# EAGLE design Lock (EAGLE 9.3.0)
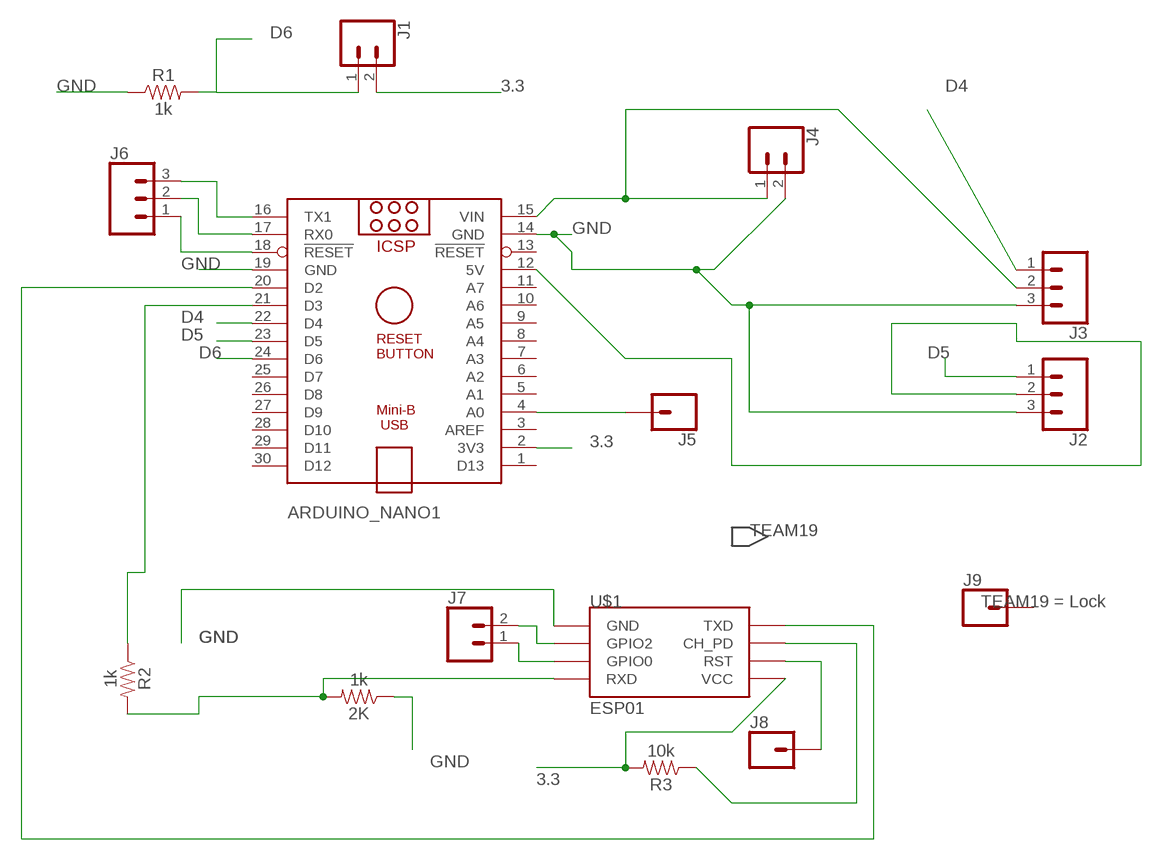
[diagram p0: schematic, sheet 1]

## Parts
2K  1k  1KOHM-HORIZ-1/4W-1%  [AXIAL-0.3]
ARDUINO_NANO1  ARDUINO_NANO  [ARDUINO_NANO]
J1  CONN_02  [1X02]
J2  CONN_03  [1X03]
J3  CONN_03  [1X03]
J4  CONN_02  [1X02]
J5  CONN_01  [1X01]
J6  CONN_03  [1X03]
J7  CONN_02  [1X02]
J8  CONN_01  [1X01]
J9  CONN_01  [1X01]
R1  1k  1KOHM-HORIZ-1/4W-1%  [AXIAL-0.3]
R2  1k  1KOHM-HORIZ-1/4W-1%  [AXIAL-0.3]
R3  10k  10KOHM-HORIZ-1/4W-1%  [AXIAL-0.3]
U$1  ESP01  [ESP01]

## Nets
3.3: ARDUINO_NANO1.2(3V3) J1.2 R3.P$2 U$1.VCC
D4: ARDUINO_NANO1.22(D4) J3.1
D5: ARDUINO_NANO1.23(D5) J2.1
D6: ARDUINO_NANO1.24(D6) J1.1 R1.P$2
GND: 2K.P$1 ARDUINO_NANO1.14(GND) ARDUINO_NANO1.19(GND) J2.3 J3.3 J4.2 R1.P$1 U$1.GND
N$1: ARDUINO_NANO1.20(D2) U$1.TX(TXD)
N$2: 2K.P$2 R2.P$2 U$1.RX(RXD)
N$3: ARDUINO_NANO1.21(D3) R2.P$1
N$4: R3.P$1 U$1.CH_PD
N$5: ARDUINO_NANO1.4(A0) J5.1
N$6: ARDUINO_NANO1.15(VIN) J3.2 J4.1
N$7: J7.2 U$1.GPIO2
N$8: J7.1 U$1.GPIO0
N$9: J8.1 U$1.RST
N$10: ARDUINO_NANO1.18(!RESET) J6.1
N$11: ARDUINO_NANO1.17(RX0) J6.2
N$12: ARDUINO_NANO1.16(TX1) J6.3
N$13: ARDUINO_NANO1.12(5V) J2.2
Unconnected: ARDUINO_NANO1.1(D13) ARDUINO_NANO1.3(AREF) ARDUINO_NANO1.5(A1) ARDUINO_NANO1.6(A2) ARDUINO_NANO1.7(A3) ARDUINO_NANO1.8(A4) ARDUINO_NANO1.9(A5) ARDUINO_NANO1.10(A6) ARDUINO_NANO1.11(A7) ARDUINO_NANO1.13(!RESET) ARDUINO_NANO1.25(D7) ARDUINO_NANO1.26(D8) ARDUINO_NANO1.27(D9) ARDUINO_NANO1.28(D10) ARDUINO_NANO1.29(D11) ARDUINO_NANO1.30(D12) J9.1

## Library data of the parts
2K R1 R2 = SparkFun-Resistors:1KOHM: 1kΩ resistor A resistor is a passive two-terminal electrical component that implements electrical resistance as a circuit element. Resistors act to reduce current flow, and, at the same time, act to lower voltage levels within circuits. - Wikipedia; PROD_ID: RES-12182
ARDUINO_NANO1 = ArduinoNanoV30:ARDUINO_NANO: Arduino Nano V3.0 Overview: The Arduino Nano is a small, complete, and breadboard-friendly board based on the ATmega328 (Arduino Nano 3.x) or ATmega168 (Arduino Nano 2.x). It has more or less the same functionality of the Arduino Duemilanove, but in a different package. It lacks only a DC power jack, and works with a Mini-B USB cable instead of a standard one. The Nano was designed and is being produced by Gravitech. Specifications: Microcontroller Atmel ATmega168 or ATmega328 Operating Voltage (logic level) 5 V Input Voltage (recommended) 7-12 V Input Voltage (limits) 6-20 V Digital I/O Pins 14 (of which 6 provide PWM output) Analog Input Pins 8 DC Current per I/O Pin 40 mA Flash Memory 16 KB (ATmega168) or 32 KB (ATmega328) of which 2 KB used by bootloader SRAM 1 KB (ATmega168) or 2 KB (ATmega328) EEPROM 512 bytes (ATmega168) or 1 KB (ATmega328) Clock Speed 16 MHz Dimensions 0.73" x 1.70" Length 45 mm Width 18 mm Weigth 5 g Power: The Arduino Nano can be powered via the Mini-B USB connection, 6-20V unregulated external power supply (pin 30), or 5V regulated external power supply (pin 27). The power source is automatically selected to the highest voltage source. Memory: The ATmega168 has 16 KB of flash memory for storing code (of which 2 KB is used for the bootloader); the ATmega328 has 32 KB, (also with 2 KB used for the bootloader). The ATmega168 has 1 KB of SRAM and 512 bytes of EEPROM (which can be read and written with the EEPROM library); the ATmega328 has 2 KB of SRAM and 1 KB of EEPROM. Input and Output: Each of the 14 digital pins on the Nano can be used as an input or output, using pinMode(), digitalWrite(), and digitalRead() functions. They operate at 5 volts. Each pin can provide or receive a maximum of 40 mA and has an internal pull-up resistor (disconnected by default) of 20-50 kOhms. In addition, some pins have specialized functions. Visit Arduino - ArduinoBoardNano <https://www.arduino.cc/en/Main/ArduinoBoardNano>
J1 J4 J7 = SparkFun-Connectors:CONN_02: Multi connection point. Often used as Generic Header-pin footprint for 0.1 inch spaced/style header connections On any of the 0.1 inch spaced packages, you can populate with these: Break Away Headers - Straight <https://www.sparkfun.com/products/116> (PRT-00116) Break Away Male Headers - Right Angle <https://www.sparkfun.com/products/553> (PRT-00553) Female Headers <https://www.sparkfun.com/products/115> (PRT-00115) Break Away Headers - Machine Pin <https://www.sparkfun.com/products/117> (PRT-00117) Break Away Female Headers - Swiss Machine Pin <https://www.sparkfun.com/products/743> (PRT-00743) For SCREWTERMINALS and SPRING TERMINALS visit here: Screw Terimnals on SparkFun.com <https://www.sparkfun.com/search/results?term=Screw+Terminals> (5mm/3.5mm/2.54mm spacing) This device is also useful as a general connection point to wire up your design to another part of your project. Our various solder wires solder well into these plated through hole pads. Hook-Up Wire - Assortment (Stranded, 22 AWG) <https://www.sparkfun.com/products/11375> (PRT-11375) Hook-Up Wire - Assortment (Solid Core, 22 AWG) <https://www.sparkfun.com/products/11367> (PRT-11367) View the entire wire category on our website here <https://www.sparkfun.com/categories/141> Special notes: Molex polarized connector foot print use with: PRT-08233 with associated crimp pins and housings. 2.54_SCREWTERM for use with PRT-10571. 3.5mm Screw Terminal footprints for PRT-08084 5mm Screw Terminal footprints for use with PRT-08432
J2 J3 J6 = SparkFun-Connectors:CONN_03: Multi connection point. Often used as Generic Header-pin footprint for 0.1 inch spaced/style header connections On any of the 0.1 inch spaced packages, you can populate with these: Break Away Headers - Straight <https://www.sparkfun.com/products/116> (PRT-00116) Break Away Male Headers - Right Angle <https://www.sparkfun.com/products/553> (PRT-00553) Female Headers <https://www.sparkfun.com/products/115> (PRT-00115) Break Away Headers - Machine Pin <https://www.sparkfun.com/products/117> (PRT-00117) Break Away Female Headers - Swiss Machine Pin <https://www.sparkfun.com/products/743> (PRT-00743) Stackable Header - 3 Pin (Female, 0.1") <https://www.sparkfun.com/products/13875> (PRT-13875) For SCREWTERMINALS and SPRING TERMINALS visit here: Screw Terimnals on SparkFun.com <https://www.sparkfun.com/search/results?term=Screw+Terminals> (5mm/3.5mm/2.54mm spacing) This device is also useful as a general connection point to wire up your design to another part of your project. Our various solder wires solder well into these plated through hole pads. Hook-Up Wire - Assortment (Stranded, 22 AWG) <https://www.sparkfun.com/products/11375> (PRT-11375) Hook-Up Wire - Assortment (Solid Core, 22 AWG) <https://www.sparkfun.com/products/11367> (PRT-11367) View the entire wire category on our website here <https://www.sparkfun.com/categories/141> Special notes: Molex polarized connector foot print use with SKU : PRT-08232 with associated crimp pins and housings.
J5 J8 = SparkFun-Connectors:CONN_01: Single connection point. Often used as Generic Header-pin footprint for 0.1 inch spaced/style header connections On any of the 0.1 inch spaced packages, you can populate with these: Break Away Headers - Straight <https://www.sparkfun.com/products/116> (PRT-00116) Break Away Male Headers - Right Angle <https://www.sparkfun.com/products/553> (PRT-00553) Female Headers <https://www.sparkfun.com/products/115> (PRT-00115) Break Away Headers - Machine Pin <https://www.sparkfun.com/products/117> (PRT-00117) Break Away Female Headers - Swiss Machine Pin <https://www.sparkfun.com/products/743> (PRT-00743) This device is also useful as a general connection point to wire up your design to another part of your project. Our various solder wires solder well into these plated through hole pads. Hook-Up Wire - Assortment (Stranded, 22 AWG) <https://www.sparkfun.com/products/11375> (PRT-11375) Hook-Up Wire - Assortment (Solid Core, 22 AWG) <https://www.sparkfun.com/products/11367> (PRT-11367) View the entire wire category on our website here <https://www.sparkfun.com/categories/141> Special notes: SMTSO-256-ET is a "flush mount" nut for a 4-40 screw. We mostly use this on specialty testbeds; it is a nice way to connect hardware to your PCB at an adjustable hieght. Also note, the SNAP packages are for using a snappable style connector. We sell a baggie of snaps and they are also used on two LilyPad designs: Snap Assortment - 30 pack (male and female) <https://www.sparkfun.com/products/11347> (DEV-11347) LilyPad Arduino SimpleSnap <https://www.sparkfun.com/products/10941> (DEV-10941) LilyPad SimpleSnap Protoboard <https://www.sparkfun.com/products/10940> (DEV-10940)
J9 = SparkFun-Connectors:CONN_01: Single connection point. Often used as Generic Header-pin footprint for 0.1 inch spaced/style header connections On any of the 0.1 inch spaced packages, you can populate with these: Break Away Headers - Straight <https://www.sparkfun.com/products/116> (PRT-00116) Break Away Male Headers - Right Angle <https://www.sparkfun.com/products/553> (PRT-00553) Female Headers <https://www.sparkfun.com/products/115> (PRT-00115) Break Away Headers - Machine Pin <https://www.sparkfun.com/products/117> (PRT-00117) Break Away Female Headers - Swiss Machine Pin <https://www.sparkfun.com/products/743> (PRT-00743) This device is also useful as a general connection point to wire up your design to another part of your project. Our various solder wires solder well into these plated through hole pads. Hook-Up Wire - Assortment (Stranded, 22 AWG) <https://www.sparkfun.com/products/11375> (PRT-11375) Hook-Up Wire - Assortment (Solid Core, 22 AWG) <https://www.sparkfun.com/products/11367> (PRT-11367) View the entire wire category on our website here <https://www.sparkfun.com/categories/141> Special notes: SMTSO-256-ET is a "flush mount" nut for a 4-40 screw. We mostly use this on specialty testbeds; it is a nice way to connect hardware to your PCB at an adjustable hieght. Also note, the SNAP packages are for using a snappable style connector. We sell a baggie of snaps and they are also used on two LilyPad designs: Snap Assortment - 30 pack (male and female) <https://www.sparkfun.com/products/11347> (DEV-11347) LilyPad Arduino SimpleSnap <https://www.sparkfun.com/products/10941> (DEV-10941) LilyPad SimpleSnap Protoboard <https://www.sparkfun.com/products/10940> (DEV-10940); TEAM19: Lock
R3 = SparkFun-Resistors:10KOHM: 10kΩ resistor A resistor is a passive two-terminal electrical component that implements electrical resistance as a circuit element. Resistors act to reduce current flow, and, at the same time, act to lower voltage levels within circuits. - Wikipedia; PROD_ID: RES-12183
U$1 = esp8266modules:ESP01: ESP8266 Wifi module 01

## Board
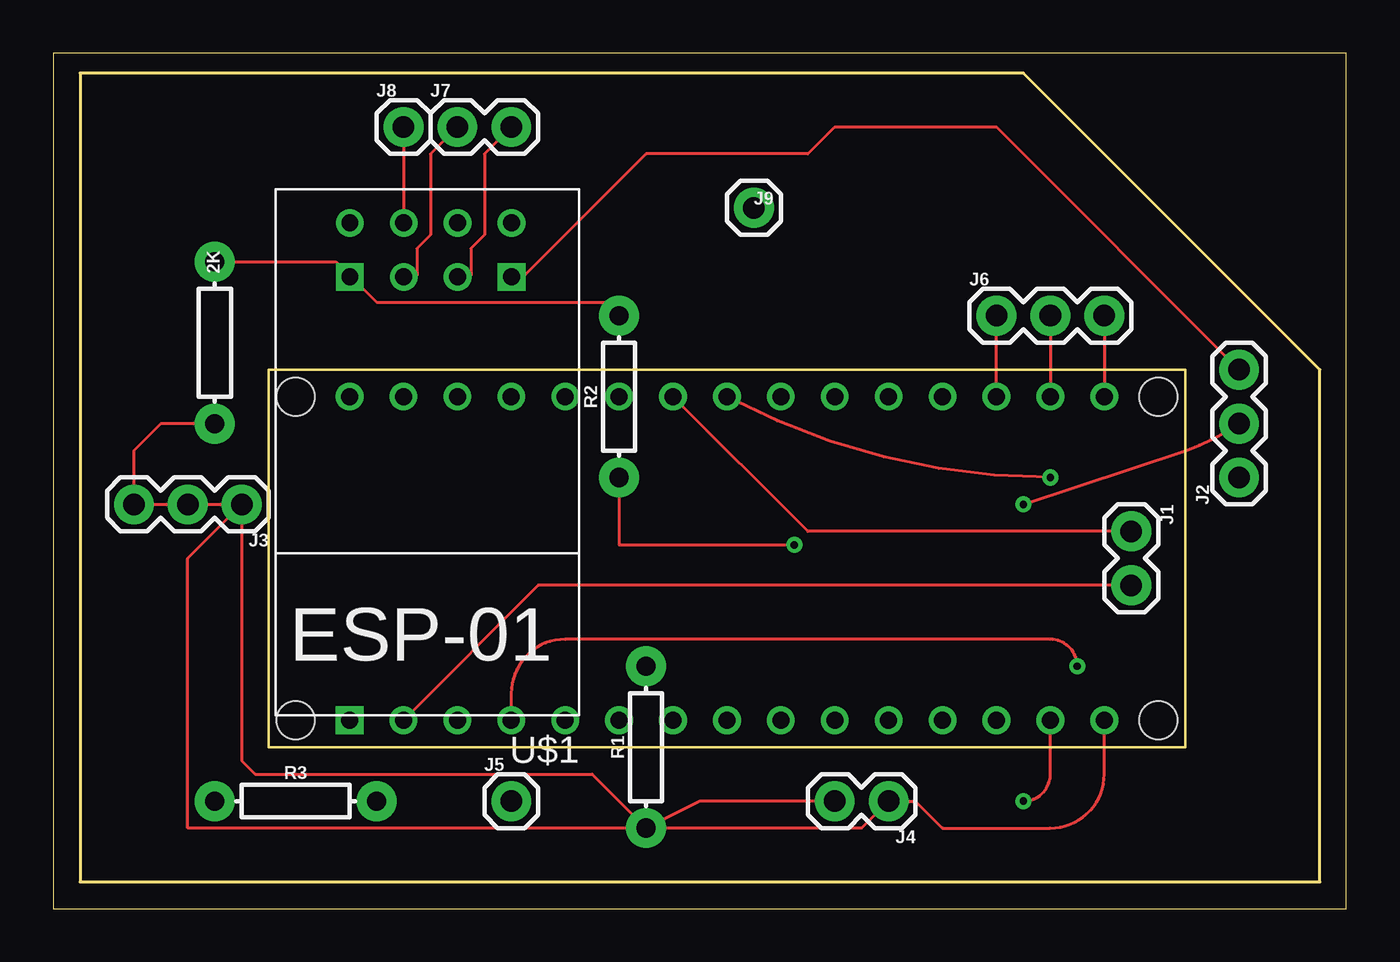
[diagram p1: board, top side]
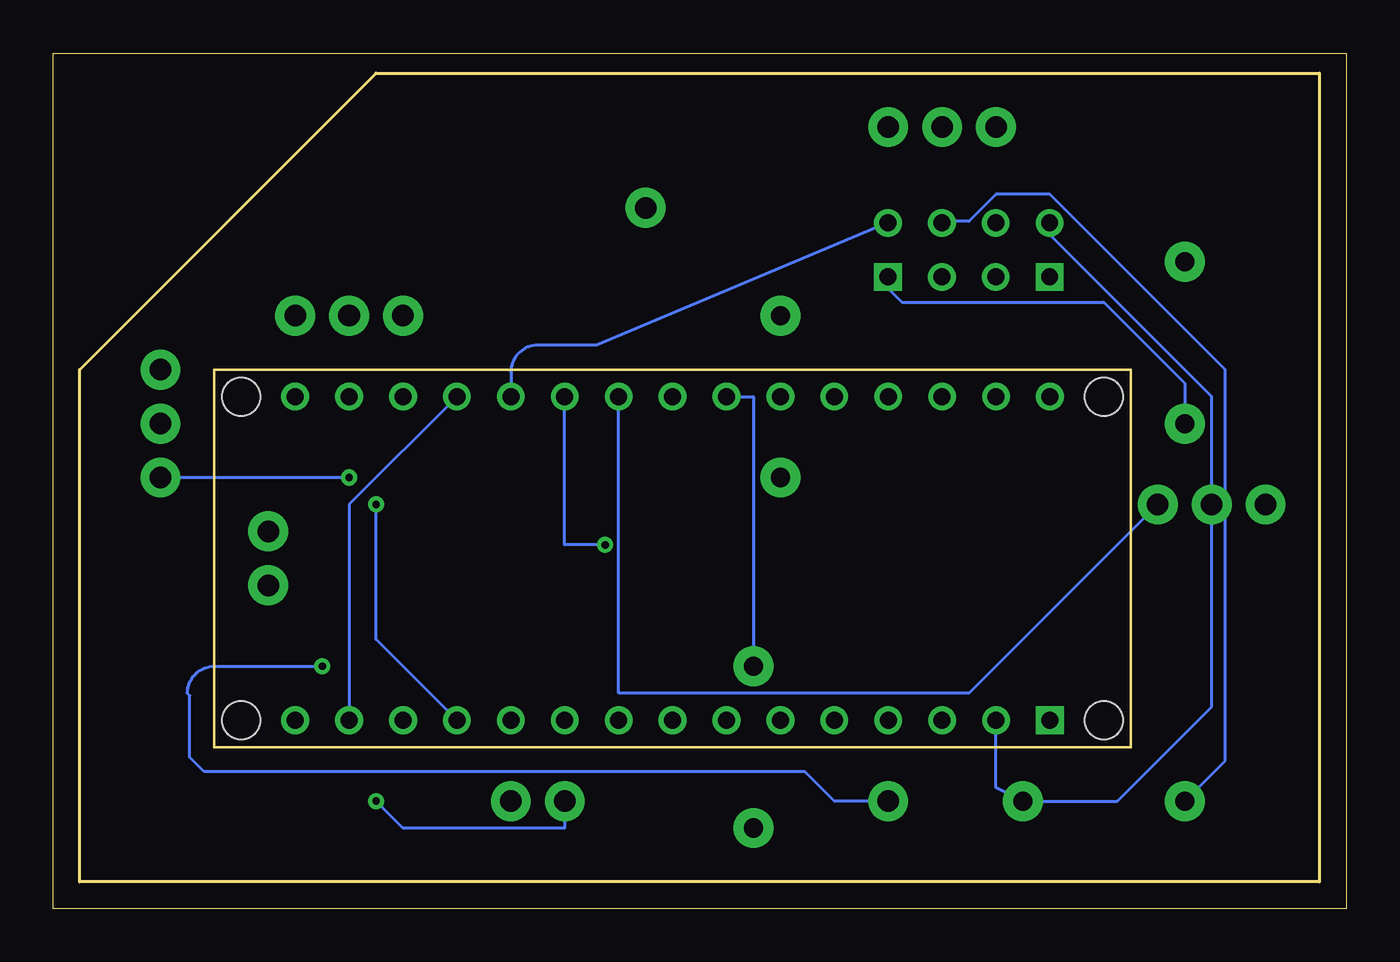
[diagram p2: board, bottom side, seen from below]

Size 60.94 x 40.31 mm. Coordinates in mm from the lower left corner, seen from the top.
Outline: 0,0 60.94,0 60.94,40.31 0,40.31 0,0
Copper layers (1*16): Top 0.035mm / dielectric 1.5mm / Bottom 0.035mm
Design rules "default": minimum track width 6mil, minimum drill 0.35mm, track to track 6mil, track to pad 6mil, pad to pad 6mil, via to via 6mil, smd to smd 6mil, copper to edge 40mil, drill to drill 6mil, minimum pad ring 10mil, minimum via ring 8mil, stop-mask expansion 4mil, vias tented up to drill 0mil, thermal gap 10mil
Milling: 5 lines

### Footprints (pad centres in the part's own frame; a part is rotated, then mirrored left to right if it is on the bottom)
AXIAL-0.3 = drill 0.9 pad 1.88: P$1 -3.81,0; P$2 3.81,0
ARDUINO_NANO = drill 0.8 square: 1 -20.32,-7.62 | drill 0.8: 2 -17.78,-7.62; 3 -15.24,-7.62; 4 -12.7,-7.62; 5 -10.16,-7.62; 6 -7.62,-7.62; 7 -5.08,-7.62; 8 -2.54,-7.62; 9 0,-7.62; 10 2.54,-7.62; 11 5.08,-7.62; 12 7.62,-7.62; 13 10.16,-7.62; 14 12.7,-7.62; 15 15.24,-7.62; 16 15.24,7.62; 17 12.7,7.62; 18 10.16,7.62; 19 7.62,7.62; 20 5.08,7.62; 21 2.54,7.62; 22 0,7.62; 23 -2.54,7.62; 24 -5.08,7.62; 25 -7.62,7.62; 26 -10.16,7.62; 27 -12.7,7.62; 28 -15.24,7.62; 29 -17.78,7.62; 30 -20.32,7.62 | hole 1.778: -22.86,-7.62; -22.86,7.62; 17.78,7.62; 17.78,-7.62
1X02 = drill 1.016 pad 1.88: 1 0,0; 2 2.54,0
1X03 = drill 1.016 pad 1.88: 1 0,0; 2 2.54,0; 3 5.08,0
1X01 = drill 1.016 pad 1.88: 1 0,0
ESP01 = drill 0.8: CH_PD -1.285,-8.178; GPIO0 1.255,-5.638; GPIO2 -1.285,-5.638; RST 1.255,-8.178; TX -3.825,-8.178; VCC 3.795,-8.178 | drill 0.8 square: GND -3.825,-5.638; RX 3.795,-5.638

### Placement (x,y rotation side)
2K  7.62,26.67 90 top
ARDUINO_NANO1  34.29,16.51 0 top
J1  50.8,17.78 270 top
J2  55.88,20.32 90 top
J3  8.89,19.05 180 top
J4  39.37,5.08 180 top
J5  21.59,5.08 0 top
J6  44.45,27.94 0 top
J7  19.05,36.83 0 top
J8  16.51,36.83 0 top
J9  33.02,33.02 0 top
R1  27.94,7.62 90 top
R2  26.67,24.13 90 top
R3  11.43,5.08 0 top
U$1  17.78,24.13 180 top

### Tracks (layer width: path | path; a pad name or v marks a point on that pad's centre or on a via)
3.3
  Top 0.152: ARDUINO_NANO1.2 22.86,15.24 J1.2
  Bottom 0.152: U$1.VCC 13.97,31.75 6.35,24.13 6.35,9.52 10.8,5.08 R3.P$2 16.51,5.71 ARDUINO_NANO1.2
D4
  Bottom 0.152: ARDUINO_NANO1.22 34.29,10.16 17.78,10.16 J3.1
D5  (via drill 0.35)
  Top 0.152: v46.99,20.32 arc-28 ARDUINO_NANO1.23
  Bottom 0.152: J2.1 v46.99,20.32
D6
  Top 0.152: ARDUINO_NANO1.24 35.56,17.78 J1.1
  Bottom 0.152: R1.P$2 27.94,24.13 ARDUINO_NANO1.24
GND  (via drill 0.35)
  Top 0.152: J4.2 30.48,5.08 R1.P$1 25.4,6.35 9.52,6.35 8.89,6.98 8.89,19.05 J3.3 3.81,21.59 5.08,22.86 2K.P$1 | U$1.GND 22.23,29.84 27.94,35.56 35.56,35.56 36.83,36.83 44.45,36.83 J2.3 | v45.72,5.08 arc90 46.99,6.35 ARDUINO_NANO1.14
  Bottom 0.152: 2K.P$1 7.62,24.77 11.43,28.58 20.95,28.58 21.59,29.21 U$1.GND | ARDUINO_NANO1.14 46.99,19.05 ARDUINO_NANO1.19 | J4.2 36.83,3.81 44.45,3.81 v45.72,5.08
N$1
  Bottom 0.152: U$1.TX 35.34,26.56 38.1,26.56 arc-90 39.37,25.29 ARDUINO_NANO1.20
N$2
  Top 0.152: 2K.P$2 13.34,30.48 13.97,29.84 U$1.RX 14.61,29.21 15.24,28.58 26.04,28.58 R2.P$2
N$3  (via drill 0.35)
  Top 0.152: v34.92,17.15 26.67,17.15 R2.P$1
  Bottom 0.152: ARDUINO_NANO1.21 36.83,17.15 v34.92,17.15
N$4
  Bottom 0.152: R3.P$1 5.71,6.98 5.71,25.4 13.97,33.66 16.51,33.66 17.78,32.38 19.05,32.38 U$1.CH_PD
N$5  (via drill 0.35)
  Top 0.152: v48.26,11.43 arc90 46.99,12.7 24.13,12.7 arc90 21.59,10.16 ARDUINO_NANO1.4
  Bottom 0.152: J5.1 24.13,5.08 25.51,6.46 53.82,6.46 54.5,7.14 54.5,10.05 54.61,10.16 arc90 53.34,11.43 v48.26,11.43
N$6
  Top 0.152: 8.89,19.05 6.35,16.51 6.35,3.81 38.1,3.81 J4.1 40.64,5.08 41.91,3.81 46.99,3.81 arc90 49.53,6.35 ARDUINO_NANO1.15 | J3.2 7.62,19.05
N$7
  Top 0.152: J7.2 20.32,35.56 20.32,31.75 19.69,31.12 19.69,29.84 U$1.GPIO2
N$8
  Top 0.152: J7.1 17.78,35.56 17.78,31.75 17.15,31.12 17.15,29.84 U$1.GPIO0
N$9
  Top 0.152: J8.1 16.51,32.38 U$1.RST
N$10
  Top 0.152: ARDUINO_NANO1.18 J6.1
N$11
  Top 0.152: J6.2 ARDUINO_NANO1.17
N$12
  Top 0.152: J6.3 ARDUINO_NANO1.16
N$13  (via drill 0.35)
  Top 0.152: v45.72,19.05 53.34,21.59 arc16 J2.2
  Bottom 0.152: ARDUINO_NANO1.12 45.72,12.7 v45.72,19.05